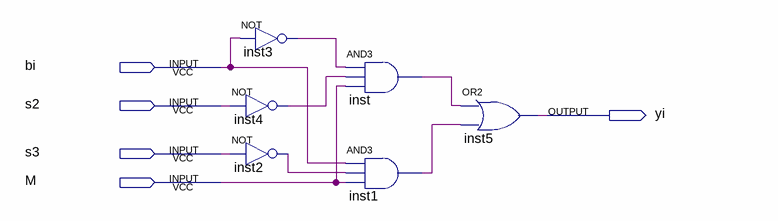
[diagram p0: schematic sheet]
// Quartus schematic arithmeticExtender.bdf as structural Verilog: 6 symbols, 5 pins
module arithmeticExtender (
  input  bi,
  input  s2,
  input  s3,
  input  M,
  output yi
);

  wire inst1_out, inst2_out, inst3_out, inst4_out, inst_out;

  not inst3 (inst3_out, bi);
  not inst4 (inst4_out, s2);
  not inst2 (inst2_out, s3);
  and inst (inst_out, inst3_out, inst4_out, M);
  and inst1 (inst1_out, bi, inst2_out, M);
  or inst5 (yi, inst_out, inst1_out);
endmodule
